# EAGLE design AcceLog_v01 (EAGLE 7.3.0)
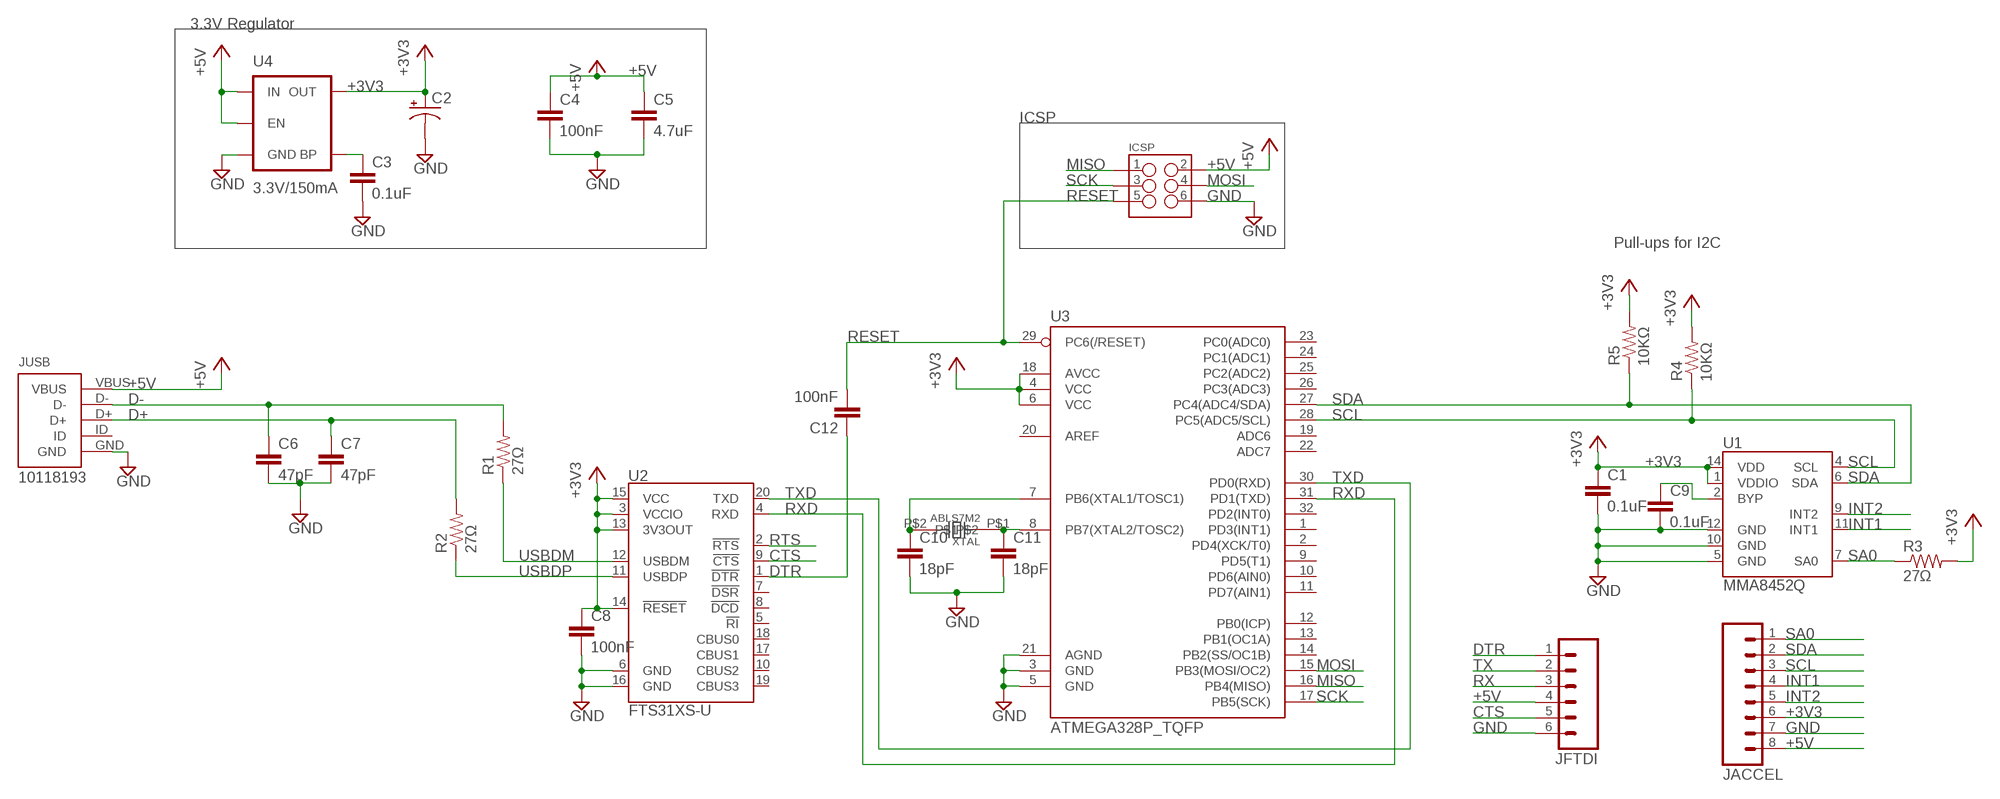
[diagram p0: schematic, sheet 1]

## Parts
C1  0.1uF  CAP0603-CAP  [0603-CAP]
C2  CAP_POL1206  [EIA3216]
C3  0.1uF  CAP0603-CAP  [0603-CAP]
C4  100nF  CAP0603-CAP  [0603-CAP]
C5  4.7uF  CAP0603-CAP  [0603-CAP]
C6  47pF  CAP0603-CAP  [0603-CAP]
C7  47pF  CAP0603-CAP  [0603-CAP]
C8  100nF  CAP0603-CAP  [0603-CAP]
C9  0.1uF  CAP0603-CAP  [0603-CAP]
C10  18pF  CAP0603-CAP  [0603-CAP]
C11  18pF  CAP0603-CAP  [0603-CAP]
C12  100nF  CAP0603-CAP  [0603-CAP]
ICSP  M03X22X3_SILK_MALE_PTH  [2X3]
JACCEL  M08LOCK  [1X08_LOCK]
JFTDI  M06LOCK  [1X06_LOCK]
JUSB  10118193  [10118193]
R1  27Ω  RESISTOR0603-RES  [0603-RES]
R2  27Ω  RESISTOR0603-RES  [0603-RES]
R3  27Ω  RESISTOR0603-RES  [0603-RES]
R4  10KΩ  RESISTOR0603-RES  [0603-RES]
R5  10KΩ  RESISTOR0603-RES  [0603-RES]
U1  MMA8452Q  [QFN-16_0.5MM]
U2  FTS31XS-U  FT231XS  [SSOP20_L]
U3  ATMEGA328P_TQFP  [TQFP32-08]
U4  3.3V/150mA  V_REG_MIC52053.3V  [SOT23-5]
XTAL  ABLS7M2  [ABLS7M2]

## Nets
+3V3: C1.1 C2.A(+) C8.1 JACCEL.6 R3.2 R4.2 R5.2 U1.1(VDDIO) U1.14(VDD) U2.3(VCCIO) U2.13(3V3OUT) U2.14(!RESET) U2.15(VCC) U3.4(VCC) U3.6(VCC) U3.18(AVCC) U4.5(OUT)
+5V: C4.1 C5.1 ICSP.2 JACCEL.8 JFTDI.4 JUSB.VBUS U4.1(IN) U4.3(EN)
CTS: JFTDI.5 U2.9(!CTS)
D+: C7.1 JUSB.D+ R2.2
D-: C6.1 JUSB.D- R1.2
DTR: C12.1 JFTDI.1 U2.1(!DTR)
GND: C1.2 C2.C(-) C3.2 C4.2 C5.2 C6.2 C7.2 C8.2 C9.2 C10.2 C11.2 ICSP.6 JACCEL.7 JFTDI.6 JUSB.GND U1.5(GND) U1.10(GND) U1.12(GND) U2.6(GND) U2.16(GND) U3.3(GND) U3.5(GND) U3.21(AGND) U4.2(GND)
INT1: JACCEL.4 U1.11(INT1)
INT2: JACCEL.5 U1.9(INT2)
MISO: ICSP.1 U3.16(PB4(MISO))
MOSI: ICSP.4 U3.15(PB3(MOSI/OC2))
N$7: C3.1 U4.4(BP)
N$10: C10.1 U3.7(PB6(XTAL1/TOSC1)) XTAL.P$2
N$11: C9.1 U1.2(BYP)
N$12: C11.1 U3.8(PB7(XTAL2/TOSC2)) XTAL.P$1
RESET: C12.2 ICSP.5 U3.29(PC6(/RESET))
RTS: U2.2(!RTS)
RX: JFTDI.3
RXD: U2.4(RXD) U3.31(PD1(TXD))
SA0: JACCEL.1 R3.1 U1.7(SA0)
SCK: ICSP.3 U3.17(PB5(SCK))
SCL: JACCEL.3 R4.1 U1.4(SCL) U3.28(PC5(ADC5/SCL))
SDA: JACCEL.2 R5.1 U1.6(SDA) U3.27(PC4(ADC4/SDA))
TX: JFTDI.2
TXD: U2.20(TXD) U3.30(PD0(RXD))
USBDM: R1.1 U2.12(USBDM)
USBDP: R2.1 U2.11(USBDP)
Unconnected: JUSB.ID U2.5(!RI) U2.7(!DSR) U2.8(!DCD) U2.10(CBUS2) U2.17(CBUS1) U2.18(CBUS0) U2.19(CBUS3) U3.1(PD3(INT1)) U3.2(PD4(XCK/T0)) U3.9(PD5(T1)) U3.10(PD6(AIN0)) U3.11(PD7(AIN1)) U3.12(PB0(ICP)) U3.13(PB1(OC1A)) U3.14(PB2(SS/OC1B)) U3.19(ADC6) U3.20(AREF) U3.22(ADC7) U3.23(PC0(ADC0)) U3.24(PC1(ADC1)) U3.25(PC2(ADC2)) U3.26(PC3(ADC3)) U3.32(PD2(INT0))

## Notes on the sheet
- 3.3V Regulator
- ICSP
- Pull-ups for I2C

## Library data of the parts
C1 C3-C12 = SparkFun-Passives:CAP: Capacitor Standard 0603 ceramic capacitor, and 0.1" leaded capacitor.
C2 = SparkFun-Capacitors:CAP_POL: Capacitor Polarized These are standard SMD and PTH capacitors. Normally 10uF, 47uF, and 100uF in electrolytic and tantalum varieties. Always verify the external diameter of the through hole cap, it varies with capacity, voltage, and manufacturer. The EIA devices should be standard.
ICSP = SparkFun-Connectors:M03X2: 2x3 .1" header. Shrouded, with keying- CONN-10681 SMT- CONN-11415 Pogo pins- HW-11044; PROD_ID: CONN-09701
JACCEL = SparkFun-Connectors:M08: Header 8 Standard 8-pin 0.1" header. Use with straight break away headers (SKU : PRT-00116), right angle break away headers (PRT-00553), swiss pins (PRT-00743), machine pins (PRT-00117), and female headers (PRT-00115).
JFTDI = SparkFun-Connectors:M06: Header 6 Standard 6-pin 0.1" header. Use with straight break away headers (SKU : PRT-00116), right angle break away headers (PRT-00553), swiss pins (PRT-00743), machine pins (PRT-00117), and female headers (PRT-00115). Molex polarized connector foot print use with SKU : PRT-08094 with associated crimp pins and housings. NOTES ON THE VARIANTS LOCK and LOCK_LONGPADS... This footprint was designed to help hold the alignment of a through-hole component (i.e. 6-pin header) while soldering it into place. You may notice that each hole has been shifted either up or down by 0.005 of an inch from it's more standard position (which is a perfectly straight line). This slight alteration caused the pins (the squares in the middle) to touch the edges of the holes. Because they are alternating, it causes a "brace" to hold the component in place. 0.005 has proven to be the perfect amount of "off-center" position when using our standard breakaway headers. Although looks a little odd when you look at the bare footprint, once you have a header in there, the alteration is very hard to notice. Also,if you push a header all the way into place, it is covered up entirely on the bottom side. This idea of altering the position of holes to aid alignment will be further integrated into the Sparkfun Library for other footprints. It can help hold any component with 3 or more connection pins.
JUSB = MicroUSB:10118193: Micro USB B Jack for Surface Mount; MPN: 10118193; OC_DIGIKEY: 609-4616-1-ND; WEBSITE: http://www.digikey.com/product-detail/en/10118193-0001LF/609-4616-1-ND/2785380
R1-R5 = SparkFun-Passives:RESISTOR: Resistor Basic schematic elements and footprints for 0603, 1206, and PTH resistors.
U1 = SparkFun-Sensors:MMA8452Q: MMA8452Q 3-Axis, 12/8-bit Digital Accelerometer Supply Voltage: 1.6-3.6V Range: +/- 2g, 4g, 8g Interface: I2C, 12-bit and 8-bit ODR: 1.56 Hz - 800 Hz Package: QFN-16 http://cache.freescale.com/files/sensors/doc/data_sheet/MMA8452Q.pdf; PROD_ID: IC-10769
U2 = SparkFun-DigitalIC:FT231X: FTDI FT231X Full Speed USB to Full-handshake UART This USB2.0 Full Speed IC offers a compact bridge to full handshake UART interfaces. The device is a UART, capable of operating up to 3MBaud, with low power consumption (8mA). The FT231X includes the complete FT-X series feature set and enables USB to be added into a system design quickly and easily over a UART interface.; PROD_ID: IC-11524
U3 = SparkFun-DigitalIC:ATMEGA328P_TQFP; PROD_ID: IC-09069
U4 = SparkFun-PowerIC:V_REG_MIC5205: V_REG MIC5205 Standard 3.3V, 5V, and Adjustable 150mA LDO voltage regulator in SOT-23 layout. Micrel part MIC5205. BP (by-pass) pin is used to lower output noise with 470pF cap, may be left open. On the adjustable version BP is used to set output.; PROD_ID: VREG-00822
XTAL = AcceLogLib:ABLS7M2; DIGIKEY: 535-12830-1-ND; WEBSITE: http://www.digikey.com/product-detail/en/ABLS7M2-16.000MHZ-D-2Y-T/535-12830-1-ND/5135076

## Board
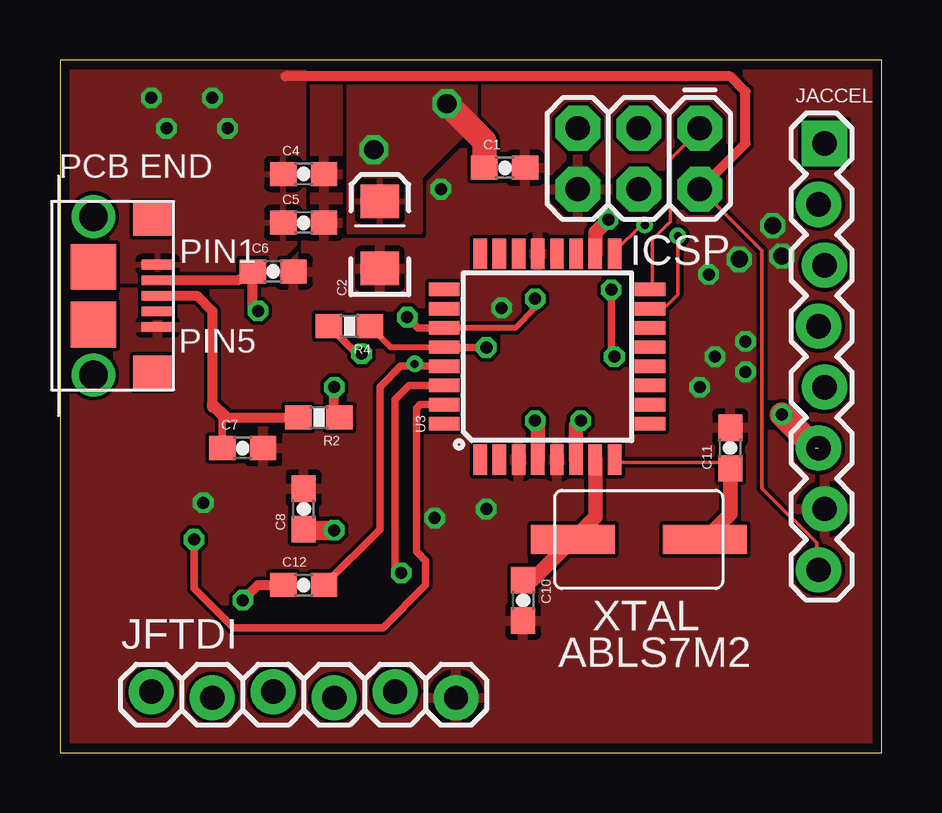
[diagram p1: board, top side]
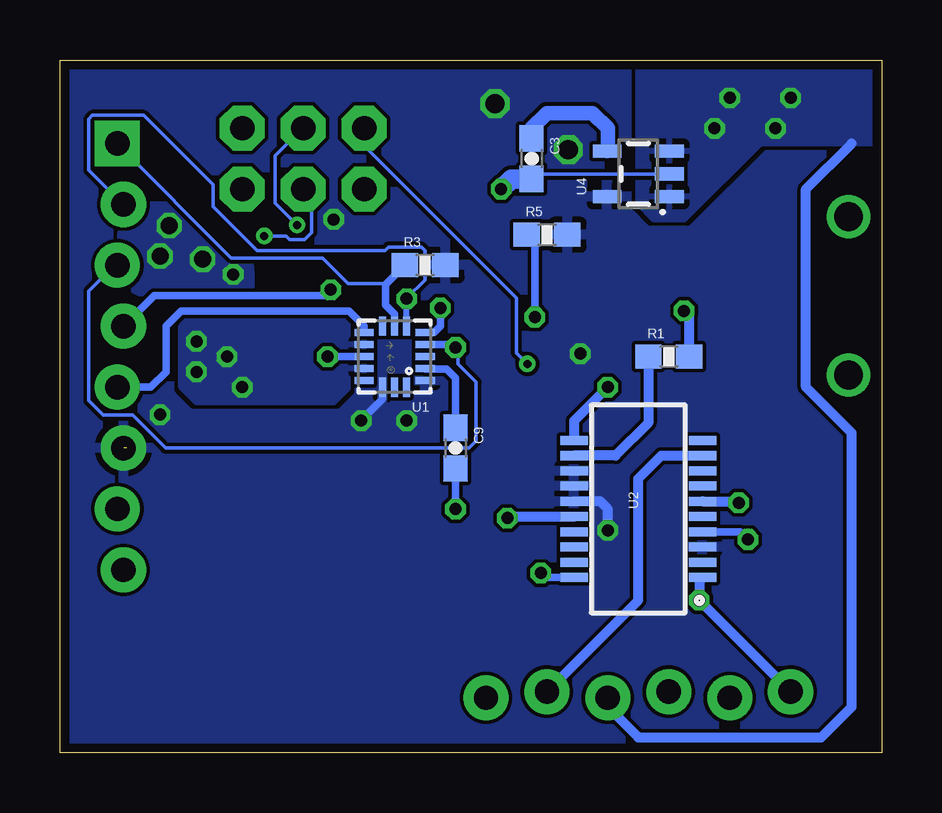
[diagram p2: board, bottom side, seen from below]

Size 34.27 x 28.88 mm. Coordinates in mm from the lower left corner, seen from the top.
Outline: 0,0 34.27,0 34.27,28.88 0,28.88 0,0
Copper layers (1*16): Top 0.0356mm / dielectric 1.5011mm / Bottom 0.0356mm
Design rules "LaenPCBOrder": minimum track width 6mil, minimum drill 13mil, track to track 6mil, track to pad 6mil, pad to pad 6mil, via to via 6mil, smd to smd 6mil, copper to edge 15mil, drill to drill 6mil, minimum pad ring 7mil, minimum via ring 7mil, stop-mask expansion 3mil, vias tented up to drill 0mil, thermal gap 10mil

### Footprints (pad centres in the part's own frame; a part is rotated, then mirrored left to right if it is on the bottom)
0603-CAP = smd 1.1 x 1: 1 -0.85,0; 2 0.85,0
EIA3216 = smd 1.4 x 1.6: A 1.4,0; C -1.4,0
2X3 = drill 1.016 pad 1.88 octagon: 1 0,0; 2 0,2.54; 3 2.54,0; 4 2.54,2.54; 5 5.08,0; 6 5.08,2.54
1X08_LOCK = drill 1.016 pad 1.88 square: 1 0,0.127 | drill 1.016 pad 1.88: 2 2.54,-0.127; 3 5.08,0.127; 4 7.62,-0.127; 5 10.16,0.127; 6 12.7,-0.127; 7 15.24,0.127; 8 17.78,-0.127
1X06_LOCK = drill 1.016 pad 1.88: 1 0,0; 2 2.54,-0.254; 3 5.08,0; 4 7.62,-0.254; 5 10.16,0; 6 12.7,-0.254
10118193 = smd 0.4 x 1.35: D+ 0,2.675; D- -0.65,2.675; GND 1.3,2.675; ID 0.65,2.675; VBUS -1.3,2.675 | smd 1.4 x 1.6: P$6 -3.2,2.45; P$7 3.2,2.45 | smd 1.9 x 1.9: P$8 1.2,0; P$9 -1.2,0 | drill 1.2 pad 1.6: P$11 3.3,0; P$12 -3.3,0
0603-RES = smd 1.1 x 1: 1 -0.85,0; 2 0.85,0
QFN-16_0.5MM = smd 0.8 x 0.3: 1 -1.275,1; 2 -1.275,0.5; 3 -1.275,0; 4 -1.275,-0.5; 5 -1.275,-1; 9 1.275,-1; 10 1.275,-0.5; 11 1.275,0; 12 1.275,0.5; 13 1.275,1 | smd 0.3 x 0.8: 6 -0.5,-1.275; 7 0,-1.275; 8 0.5,-1.275; 14 0.5,1.275; 15 0,1.275; 16 -0.5,1.275
SSOP20_L = smd 0.381 x 1.143: 1 -2.857,-2.68; 2 -2.223,-2.68; 3 -1.587,-2.68; 4 -0.953,-2.68; 5 -0.318,-2.68; 6 0.318,-2.68; 7 0.953,-2.68; 8 1.587,-2.68; 9 2.223,-2.68; 10 2.857,-2.68; 11 2.857,2.68; 12 2.223,2.68; 13 1.587,2.68; 14 0.953,2.68; 15 0.318,2.68; 16 -0.318,2.68; 17 -0.953,2.68; 18 -1.587,2.68; 19 -2.223,2.68; 20 -2.857,2.68
TQFP32-08 = smd 1.27 x 0.559: 1 -4.293,2.8; 2 -4.293,2; 3 -4.293,1.2; 4 -4.293,0.4; 5 -4.293,-0.4; 6 -4.293,-1.2; 7 -4.293,-2; 8 -4.293,-2.8; 17 4.293,-2.8; 18 4.293,-2; 19 4.293,-1.2; 20 4.293,-0.4; 21 4.293,0.4; 22 4.293,1.2; 23 4.293,2; 24 4.293,2.8 | smd 0.559 x 1.27: 9 -2.8,-4.293; 10 -2,-4.293; 11 -1.2,-4.293; 12 -0.4,-4.293; 13 0.4,-4.293; 14 1.2,-4.293; 15 2,-4.293; 16 2.8,-4.293; 25 2.8,4.293; 26 2,4.293; 27 1.2,4.293; 28 0.4,4.293; 29 -0.4,4.293; 30 -1.2,4.293; 31 -2,4.293; 32 -2.8,4.293
SOT23-5 = smd 0.55 x 1.2: 1 -0.95,-1.3; 2 0,-1.3; 3 0.95,-1.3; 4 0.95,1.3; 5 -0.95,1.3
ABLS7M2 = smd 3.5 x 1.2: P$1 -2.75,0; P$2 2.75,0

### Placement (x,y rotation side)
C1  18.54,24.38 0 top
C2  13.34,21.59 90 top
C3  14.61,24.77 270 bottom
C4  10.16,24.13 0 top
C5  10.16,22.1 0 top
C6  8.89,20.07 0 top
C7  7.62,12.7 0 top
C8  10.16,10.16 90 top
C9  17.78,12.7 270 bottom
C10  19.3,6.35 270 top
C11  27.94,12.7 90 top
C12  10.16,6.99 0 top
ICSP  26.67,26.04 180 top
JACCEL  31.75,25.4 270 top
JFTDI  3.81,2.54 0 top
JUSB  1.4,19.05 270 top
R1  8.89,16.51 0 bottom
R2  10.79,13.97 180 top
R3  19.05,20.32 0 bottom
R4  12.06,17.78 180 top
R5  13.97,21.59 0 bottom
U1  20.32,16.51 180 bottom
U2  10.16,10.16 90 bottom
U3  20.32,16.51 90 top
U4  10.16,24.13 90 bottom
XTAL  24.13,8.89 180 top

### Tracks (layer width: path | path; a pad name or v marks a point on that pad's centre or on a via)
+3V3  (via drill 0.5, 0.8)  (1 unrouted)
  Top 0.305: R4.2 12.36,16.64 v12.57,16.64
  Top 0.61: U3.4 19.92,13.61 v19.81,13.84 | U3.6 21.52,13.65 v21.72,13.84 | v22.86,22.23 22.32,21.68 U3.18
  Top 0.813: v11.43,9.27 10.12,9.27 C8.1
  Top 1.016: v16.13,27.05 17.69,25.49 C1.1 | v30.1,14.1 31.5,12.7 31.75,12.7
  Bottom 0.152: 12.84,11.12 12.8,11.18 U2.14
  Bottom 0.305: U1.14 20.82,14.74 v21.72,13.84
  Bottom 0.406: v11.43,9.27 11.43,10.16 11.75,10.48 U2.15
  other vias: 13.08,25.15
  pour Bottom (rank 5): 0,30.48 36.83,30.48 36.83,-5.08 0,-5.08
  pour Top (rank 3): 12.06,30.48 17.27,30.48 17.27,26.29 14.99,24 14.99,21.72 12.06,21.72
+5V  (via drill 0.5)
  Top 0.152: JACCEL.8 31.55,7.67 31.55,8.74 29.26,11.02 29.26,20.93 26.82,23.37 ICSP.2
  Top 0.406: ICSP.2 28.57,25.4 28.57,27.56 27.94,28.19 9.4,28.19
  Bottom 0.406: JFTDI.4 11.43,1.91 10.16,0.64 2.54,0.64 1.27,1.91 1.27,13.34 3.17,15.24 3.17,23.5 1.27,25.4
  other vias: 6.99,26.04 6.35,27.3 4.45,26.04 3.81,27.3
  pour Top (rank 3): -3.81,19.68 8.26,19.68 10.16,21.59 10.16,30.48 -3.81,30.48
  pour Bottom (rank 3): -1.27,25.4 5.08,25.4 8.26,22.23 9.53,22.23 10.16,22.86 10.16,31.75 -1.27,31.75
CTS
  Bottom 0.406: JFTDI.5 10.16,6.35 10.16,11.43 9.21,12.38 U2.9
D+
  Top 0.305: C7.1 6.77,13.97 6.35,14.39
  Top 0.406: JUSB.D+ 5.71,19.05 6.35,18.41 6.35,14.61 | 6.35,14.61 6.99,13.97 R2.2 | 6.35,14.39 6.35,14.61
D-  (via drill 0.5)
  Top 0.406: JUSB.D- 7.42,19.7 C6.1 8.04,18.63 v8.26,18.41
  Bottom 0.406: R1.2 8.04,18.2 v8.26,18.41
DTR  (via drill 0.5)
  Top 0.406: v7.62,6.35 8.26,6.99 C12.1
  Bottom 0.406: U2.1 7.62,7.16 v7.62,6.35 JFTDI.1
GND  (via drill 0.5, 0.7)
  Bottom 0.152: U4.2 14.33,24.13 C3.2
  Bottom 0.305: v18.41,18.54 18.41,17.78 18.68,17.51 U1.5 | C9.2 v17.78,10.16
  Bottom 0.406: U2.6 6.03,10.48 v5.97,10.41 | v15.62,9.78 15.56,9.84 U2.16
  Bottom 0.813: v15.88,23.5 15.46,23.91 C3.2
  other vias: 27.3,16.51 28.57,17.14 28.57,15.88 26.67,15.24 27.05,19.94 28.32,20.57 29.72,21.97 30.1,20.7
  pour Top (rank 5): -1.27,31.75 35.56,31.75 35.56,-2.54 -1.27,-2.54
  pour Bottom: 22.86,18.41 21.59,17.14 21.59,15.88 22.86,14.61 28.57,14.61 29.21,15.24 29.21,17.78 28.57,18.41
  pour Bottom: 26.67,19.05 30.48,19.05 arc90 31.75,20.32 31.75,21.59 arc90 30.48,22.86 29.21,22.86 arc90 26.29,19.94 26.29,19.43 arc90
INT1  (via drill 0.5)
  Top 0.305: v22.99,19.3 22.99,16.64 v23.11,16.51
  Bottom 0.305: U1.11 v23.11,16.51 | JACCEL.4 30.35,19.05 23.24,19.05 v22.99,19.3
INT2
  Bottom 0.305: U1.9 21.59,17.79 22.23,18.41 29.21,18.41 29.84,17.78 29.84,15.88 30.48,15.24 JACCEL.5
MISO
  Top 0.152: U3.16 24.69,19.41 24.69,21.39 25.45,22.15 25.45,24.74 26.67,25.96 ICSP.1
MOSI  (via drill 0.33)
  Top 0.152: v25.76,21.54 25.76,19.1 25.3,18.64 24.69,18.64 U3.15
  Bottom 0.152: v25.76,21.54 24.84,21.54 24.69,21.39 24.08,21.39 23.77,21.69 23.77,23.06 24.08,23.37 ICSP.4
N$7
  Bottom 0.61: U4.4 11.43,25.11 11.43,26.04 12.06,26.67 13.97,26.67 14.61,26.04 C3.1
N$10
  Top 0.61: U3.7 22.32,9.83 XTAL.P$2 19.69,7.2 C10.1
N$11
  Bottom 0.305: U1.2 19.04,16 18.16,16 17.78,15.62 C9.1
N$12
  Top 0.152: U3.8 23.16,12.09 27.89,12.09 C11.1
  Top 0.61: XTAL.P$1 27.94,9.95 C11.1
RESET  (via drill 0.33)
  Top 0.152: v14.78,16.2 14.78,16.11
  Top 0.305: C12.2 13.34,9.31 13.34,15.24 14.21,16.11 14.78,16.11 U3.29
  Bottom 0.152: v14.78,16.2 15.24,16.66 15.24,18.95 21.49,25.2 21.49,25.96 ICSP.5
RXD  (via drill 0.5)
  Top 0.305: U3.31 15.02,14.51 14.86,14.35 14.86,8.38 15.24,8 15.24,6.99 13.46,5.21 7.24,5.21 5.59,6.86 v5.59,8.89
  Bottom 0.305: v5.59,8.89 5.91,9.21 U2.4
SA0
  Bottom 0.152: 20.69,19.53 20.73,19.56 22.25,19.56 23.32,20.62 27.13,20.62 31.85,25.35 JACCEL.1
  Bottom 0.305: U1.7 20.32,18.29 20.7,18.67 20.7,19.52 20.69,19.53 R3.1
SCK  (via drill 0.33)
  Top 0.152: v24.38,22 24.23,22 23.16,20.93 U3.17
  Bottom 0.152: v24.38,22 25.3,22.91 25.3,24.89 24.23,25.96 ICSP.3
SCL  (via drill 0.5)
  Top 0.254: R4.1 13.79,16.91 U3.28
  Top 0.305: v17.78,16.89 16.05,16.89 U3.28
  Bottom 0.152: v17.78,16.89 17.68,16.82 17.68,16.2 16.92,15.44 16.92,13.01 17.22,12.7 29.87,12.7 31.24,14.07 32.46,14.07 33.07,14.68 33.07,19.25 32,20.32 JACCEL.3
  Bottom 0.305: U1.4 17.9,17.01 v17.78,16.89
SDA  (via drill 0.5)
  Top 0.254: v19.81,18.92 19.81,18.54 18.98,17.71 U3.27
  Top 0.305: v14.48,18.16 14.93,17.71 U3.27
  Bottom 0.152: JACCEL.2 31.7,22.91 33.07,24.28 33.07,26.42 32.92,26.57 30.79,26.57 27.89,23.67 27.89,22.76 26.06,20.93 20.73,20.93 20.57,21.08 19.2,21.08 19.05,20.93 19.05,19.71 19.81,18.95 v19.81,18.92
  Bottom 0.254: U1.6 19.82,18.79 v19.81,18.92
  Bottom 0.305: R5.1 arc90 14.48,21.25 v14.48,18.16
TXD  (via drill 0.5)
  Top 0.305: U3.30 14.55,15.31 13.97,14.73 13.97,7.75 v14.22,7.49
  Bottom 0.305: v14.22,7.49 14.03,7.3 U2.20
USBDM
  Bottom 0.406: R1.1 9.74,13.76 11.11,12.38 U2.12
USBDP  (via drill 0.5)
  Top 0.406: R2.1 11.43,14.19 v11.43,15.24
  Bottom 0.406: v11.43,15.24 12.84,13.83 U2.11